# Altium schematic sheet sch.SchDoc
size A; SheetNumber: 1; SheetTotal: 1
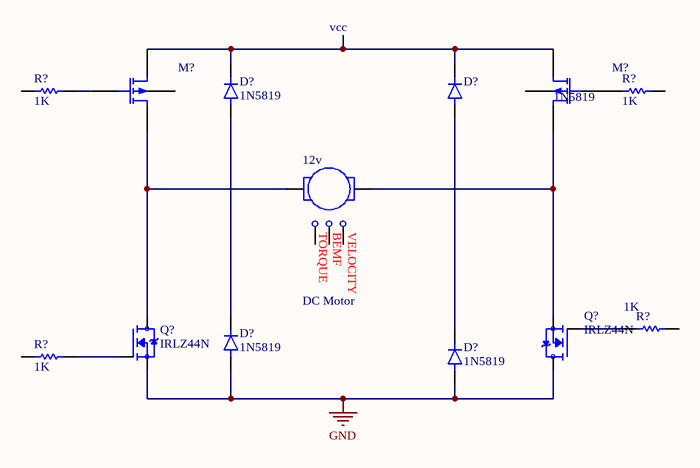
[diagram p0: sch.SchDoc]

## Parts
(Parts that share a designator on the sheet are numbered #1, #2 ... from top to bottom, then left to right.)
12v  DC Motor
D?#1  1N5819  [DIOAD1036W78L470D235]
D?#2  1N5819  [DIOAD1036W78L470D235]
D?#3  1N5819  [DIOAD1036W78L470D235]
D?#4  1N5819  [DIOAD1036W78L470D235]
M?#1  P-channel MOS1 MOSFET Shichman and Hodges Model  (value not drawn)
M?#2  P-channel MOS1 MOSFET Shichman and Hodges Model  (value not drawn)
Q?#1  IRLZ44N  [TO254P1054X469X1930-3]
Q?#2  IRLZ44N  [TO254P1054X469X1930-3]
R?#1  value 1K  (hidden comment: Resistor)
R?#2  value 1K  (hidden comment: Resistor)
R?#3  value 1K  (hidden comment: Resistor)
R?#4  value 1K  (hidden comment: Resistor)

## Nets
GND: D?#3.A D?#4.A Q?#1.3(S) Q?#2.2(D)
Net12v_1: 12v.1 M?#2.1(D) Q?#2.3(S)
Net12v_2: 12v.2 M?#1.3(S) Q?#1.2(D)
NetD?#1_A: D?#1.A D?#3.C(K)
NetD?#1_C: D?#1.C(K) D?#2.C(K) M?#1.1(D) M?#2.3(S)
NetD?#2_A: D?#2.A D?#4.C(K)
NetM?#1_2: M?#1.2(G) R?#1.2
NetM?#2_2: M?#2.2(G) R?#2.1
NetQ?#1_1: Q?#1.1(G) R?#4.2
NetQ?#2_1: Q?#2.1(G) R?#3.1

Not connected (* = marked no-connect by the designer): 12v 3 4 5; M?#1 4(B); M?#2 4(B); R?#1 1; R?#2 2; R?#3 2; R?#4 1

## Notes on the sheet
- vcc
- (in symbol DC Motor) TORQUE; BEMF; VELOCITY

## Library data of the parts
12v = DC Motor: LA: 1.5M; RA: 0.5; KE: 0.05; JM: 250U; BM: 0.1M; TL: 0; SimulationGenericComponent: True; KT: 0.05
D?#1-D?#4 = 1N5819: 1A, 40V, Schottky Rectifier; MF: Taiwan Semiconductor; SnapEDA_Link: https://www.snapeda.com/parts/1N5819/Taiwan+Semiconductor/view-part/?ref=snap; Package: DO-41 Taiwan Semiconductor; MP: 1N5819; Value: *; Purchase-URL: https://pricing.snapeda.com/search/part/1N5819/?ref=eda; Check_prices: https://www.snapeda.com/parts/1N5819/Taiwan+Semiconductor/view-part/?ref=eda; Availability: In Stock; Price: None
M?#1 M?#2 = MOSFET P-ch Lev1: CBD: 0; FC: 0.5; IS: 1e-14; KP: 2e-05; PB: 0.8; PHI: 0.6; TNOM: 27; SimulationGenericComponent: True; CBS: 0; CGBO: 0; CGDO: 0; CGSO: 0; CJ: 0; CJSW: 0; GAMMA: 0; JS: 0; LAMBDA: 0; LD: 0; MJ: 0.5; MJSW: 0.5; NSS: 0; NSUB: 0; RD: 0; RS: 0; RSH: 0; TOX: 0; TPG: 0; U0: 0; VTO: 0
Q?#1 Q?#2 = IRLZ44N: N-Channel 55 V 47A (Tc) 3.8W (Ta), 110W (Tc) Surface Mount D2PAK; MF: Infineon / IR; Package: TO-220-3 Infineon / IR; Availability: Not in stock; Value: *; MP: IRLZ44N; Check_prices: https://www.snapeda.com/parts/IRLZ44N/Infineon/view-part/?ref=eda; Price: None; SnapEDA_Link: https://www.snapeda.com/parts/IRLZ44N/Infineon/view-part/?ref=snap
R?#1-R?#4 = Resistor: TC1: 0; SimulationGenericComponent: True; TC2: 0